# Altium project 200310 Brake Module R3.PrjPcb
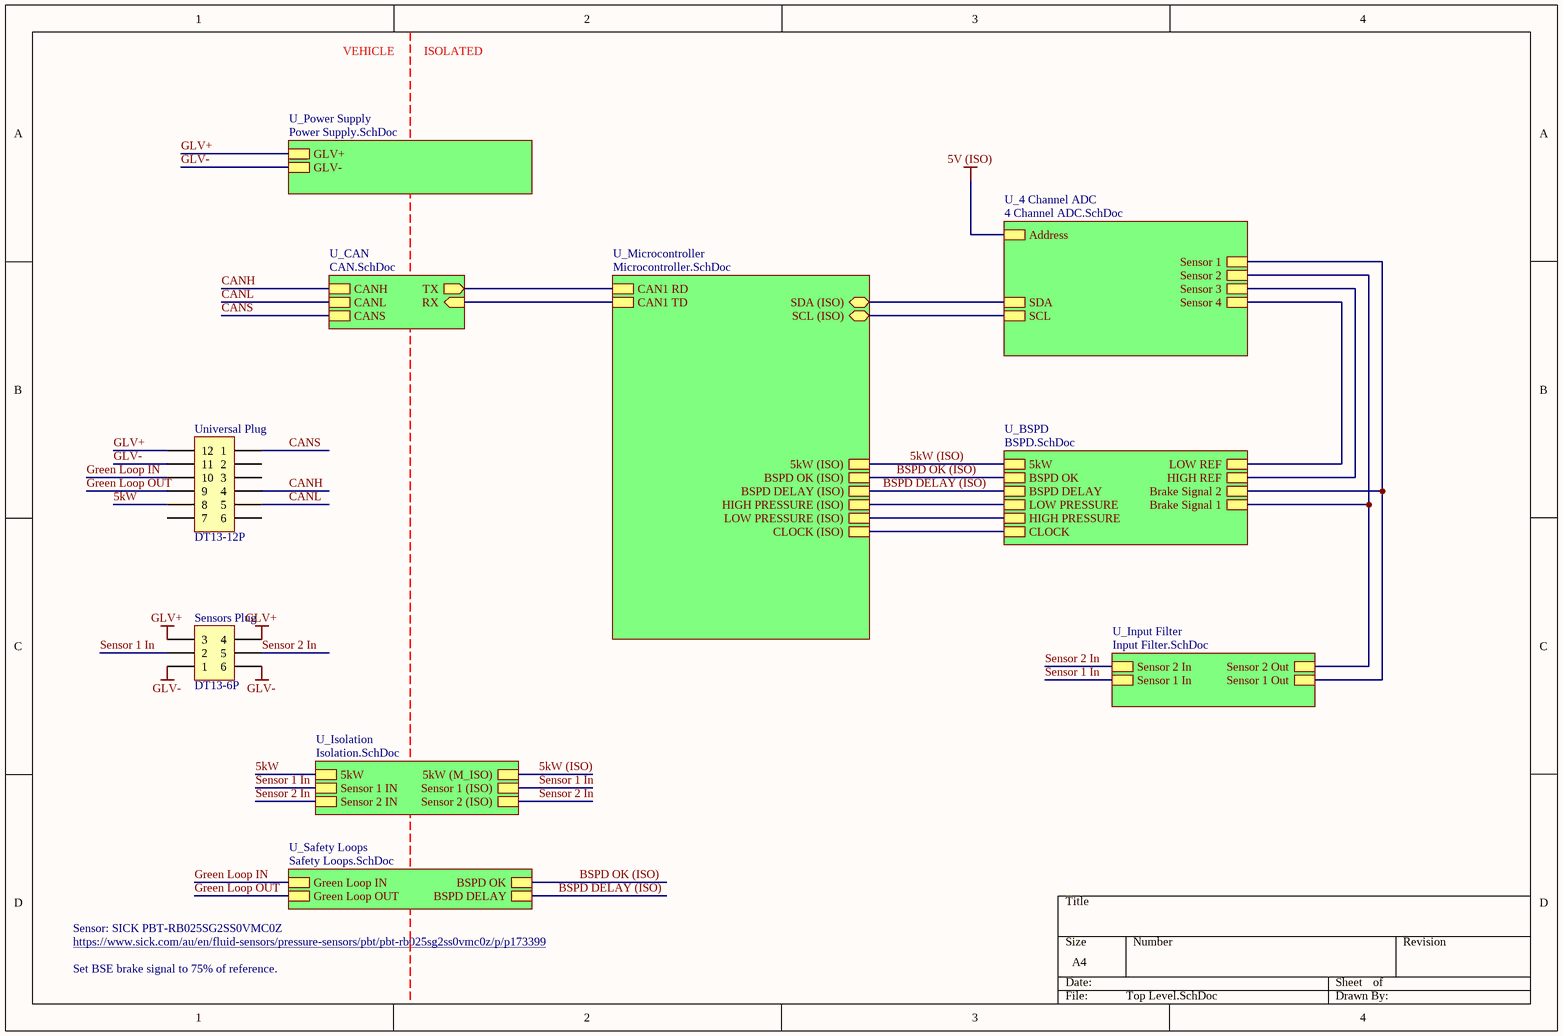
[diagram p0: Top Level.SchDoc]
8 sheets, 139 parts. Net scope: hierarchical (ports join the sheet entries above them; power ports are global).
Board file: Brake Module PCB.PcbDoc
Sheets:
  Top Level.SchDoc
    U_BSPD = BSPD.SchDoc
    U_4 Channel ADC = 4 Channel ADC.SchDoc
    U_Input Filter = Input Filter.SchDoc
    U_Microcontroller = Microcontroller.SchDoc
    U_Safety Loops = Safety Loops.SchDoc
    U_CAN = CAN.SchDoc
    U_Isolation = Isolation.SchDoc

## Sheet Top Level.SchDoc
size A4

### Parts
Sensors_Plug  DT13-6P  [DT13-6P]
Universal_Plug  DT13-12P  [DT13-12P]

### Sub-sheets
U_4 Channel ADC = 4 Channel ADC.SchDoc: Address, SCL, SDA, Sensor 1, Sensor 2, Sensor 3, Sensor 4
U_BSPD = BSPD.SchDoc: BSPD OK, HIGH PRESSURE, LOW PRESSURE, CLOCK, HIGH REF, LOW REF, 5kW, Brake Signal 1, Brake Signal 2, BSPD DELAY
U_CAN = CAN.SchDoc: CANS, RX (in), CANL, CANH, TX (out)
U_Input Filter = Input Filter.SchDoc: Sensor 1 In, Sensor 1 Out, Sensor 2 In, Sensor 2 Out
U_Isolation = Isolation.SchDoc: 5kW, 5kW (M_ISO), Sensor 2 IN, Sensor 1 IN, Sensor 2 (ISO), Sensor 1 (ISO)
U_Microcontroller = Microcontroller.SchDoc: BSPD OK (ISO), 5kW (ISO), CLOCK (ISO), HIGH PRESSURE (ISO), LOW PRESSURE (ISO), SDA (ISO) (bidir), SCL (ISO) (bidir), CAN1 RD, CAN1 TD, BSPD DELAY (ISO)
U_Power Supply = Power Supply.SchDoc (file not in this document): GLV+, GLV-
U_Safety Loops = Safety Loops.SchDoc: Green Loop OUT, Green Loop IN, BSPD OK, BSPD DELAY

### Nets
GLV+: Sensors_Plug.3 Sensors_Plug.4 Universal_Plug.12 ; sheet U_Power Supply/GLV+
GLV-: Sensors_Plug.1 Sensors_Plug.6 Universal_Plug.11 ; sheet U_Power Supply/GLV-
5kW: Universal_Plug.8 ; sheet U_Isolation/5kW
5kW (ISO): sheet U_BSPD/5kW, sheet U_Microcontroller/5kW (ISO), sheet U_Isolation/5kW (M_ISO)
BSPD DELAY (ISO): sheet U_BSPD/BSPD DELAY, sheet U_Microcontroller/BSPD DELAY (ISO), sheet U_Safety Loops/BSPD DELAY
BSPD OK (ISO): sheet U_BSPD/BSPD OK, sheet U_Microcontroller/BSPD OK (ISO), sheet U_Safety Loops/BSPD OK  [project net BSPD OK]
CANH: Universal_Plug.4 ; sheet U_CAN/CANH
CANL: Universal_Plug.5 ; sheet U_CAN/CANL
CANS: Universal_Plug.1 ; sheet U_CAN/CANS
CLOCK: sheet U_BSPD/CLOCK, sheet U_Microcontroller/CLOCK (ISO)
Green Loop IN: Universal_Plug.10 ; sheet U_Safety Loops/Green Loop IN
Green Loop OUT: Universal_Plug.9 ; sheet U_Safety Loops/Green Loop OUT
H REF: sheet U_BSPD/HIGH REF, sheet U_4 Channel ADC/Sensor 3
L REF: sheet U_BSPD/LOW REF, sheet U_4 Channel ADC/Sensor 4
Sensor 1 In: Sensors_Plug.2 ; sheet U_Input Filter/Sensor 1 In, sheet U_Isolation/Sensor 1 IN, sheet U_Isolation/Sensor 1 (ISO)
Sensor 2 In: Sensors_Plug.5 ; sheet U_Input Filter/Sensor 2 In, sheet U_Isolation/Sensor 2 IN, sheet U_Isolation/Sensor 2 (ISO)
NetC48_2: sheet U_BSPD/Brake Signal 2, sheet U_4 Channel ADC/Sensor 1, sheet U_Input Filter/Sensor 1 Out
NetC49_2: sheet U_BSPD/Brake Signal 1, sheet U_4 Channel ADC/Sensor 2, sheet U_Input Filter/Sensor 2 Out
NetCAN_RX_TP_1: sheet U_Microcontroller/CAN1 TD, sheet U_CAN/RX
NetCAN_TX_TP_1: sheet U_Microcontroller/CAN1 RD, sheet U_CAN/TX
NetP9_1: sheet U_BSPD/HIGH PRESSURE, sheet U_Microcontroller/LOW PRESSURE (ISO)
NetP11_1: sheet U_BSPD/LOW PRESSURE, sheet U_Microcontroller/HIGH PRESSURE (ISO)
NetR43_1: sheet U_4 Channel ADC/SCL, sheet U_Microcontroller/SCL (ISO)
NetR44_1: sheet U_4 Channel ADC/SDA, sheet U_Microcontroller/SDA (ISO)

Not connected (* = marked no-connect by the designer): Universal_Plug 2 3 6 7

### Notes on the sheet
- VEHICLE
- ISOLATED
- Sensor: SICK PBT-RB025SG2SS0VMC0Z
- https://www.sick.com/au/en/fluid-sensors/pressure-sensors/pbt/pbt-rb025sg2ss0vmc0z/p/p173399
- Set BSE brake signal to 75% of reference.

### Library data of the parts
Sensors_Plug = DT13-6P[[/\]]DT13-6P: Positions: 6; Pitch: 4.44mm; Row Spacing: 6.35mm; Angle: 90; Flange: Yes; Contact: Copper Alloy; Part Number: DT13-6P; Digikey Part Number: 1734-1025-ND; Digikey Link: https://www.digikey.com/product-detail/en/te-connectivity-deutsch-connectors/DT13-6P/1734-1025-ND/6566589
Universal_Plug = DT13-12P[[/\]]DT13-12P: Positions: 12; Pitch: 4.44mm; Row Spacing: 6.35mm; Angle: 90; Flange: Yes; Contact: Nickel; Part Number: DT13-12P; Digikey Part Number: 1734-1451-ND; Digikey Link: https://www.digikey.com.au/product-detail/en/te-connectivity-deutsch-connectors/DT13-12PA/1734-1451-ND/7220123

## Sheet BSPD.SchDoc
size A4
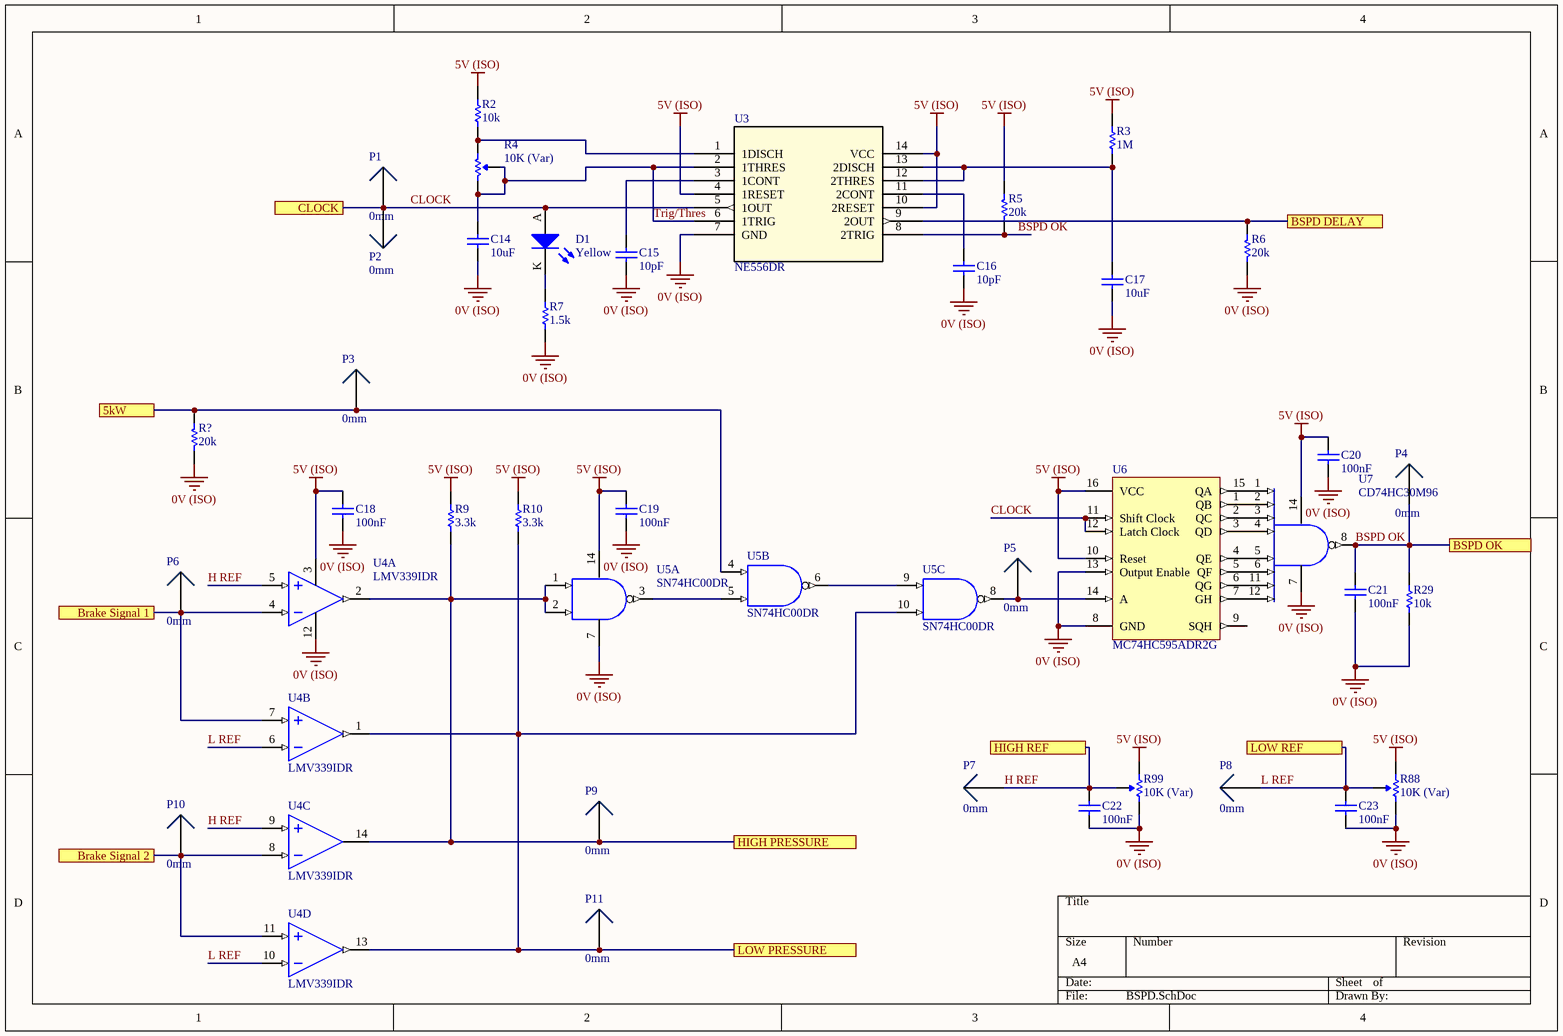
[diagram p1: BSPD.SchDoc]

### Parts
C14  10uF  [0805]
C15  10pF  [0805]
C16  10pF  [0805]
C17  10uF  [0805]
C18  100nF  [0805]
C19  100nF  [0805]
C20  100nF  [0805]
C21  100nF  [0805]
C22  100nF  [0805]
C23  100nF  [0805]
D1  Yellow  [0805 LED]
P1  0mm  [SMD Test Point]
P2  0mm  [TH Test Point]
P3  0mm  [SMD Test Point]
P4  0mm  [SMD Test Point]
P5  0mm  [SMD Test Point]
P6  0mm  [TH Test Point]
P7  0mm  [TH Test Point]
P8  0mm  [TH Test Point]
P9  0mm  [SMD Test Point]
P10  0mm  [TH Test Point]
P11  0mm  [SMD Test Point]
R2  10k  [0805]
R3  1M  [0805]
R4  10K (Var)  [B 3296]
R5  20k  [0805]
R6  20k  [0805]
R7  1.5k  [0805]
R9  3.3k  [0805]
R10  3.3k  [0805]
R29  10k  [0805]
R88  10K (Var)  [B 3296]
R99  10K (Var)  [B 3296]
R?  20k  [0805]
U3  NE556DR  [TI 14-SOIC]
U4  LMV339IDR  [TI 14-SOIC]  (parts A,B,C,D of 4)
U5  SN74HC00DR  [TI 14-SOIC]  (parts A,B,C of 4)
U6  MC74HC595ADR2G  [ON 16-SOIC]
U7  CD74HC30M96  [TI 14-SOIC]

### Ports
5kW, Brake Signal 1, Brake Signal 2, BSPD DELAY, BSPD OK, CLOCK, HIGH PRESSURE, HIGH REF, LOW PRESSURE, LOW REF

### Nets
0V (ISO): C14.1 C15.1 C16.1 C17.1 C18.1 C19.1 C20.1 C21.1 C22.1 C23.1 R6.2 R7.1 R29.1 R88.1(CCW) R99.1(CCW) R?.2 U3.7(GND) U4.12(V-) U5.7(GND) U6.8(GND) U6.13(Output_Enable) U7.7(GND)
5V (ISO): C18.2 C19.2 C20.2 R2.2 R3.2 R5.1 R9.2 R10.2 R88.3(CW) R99.3(CW) U3.4(1RESET) U3.10(2RESET) U3.14(VCC) U4.3(V+) U5.14(VCC) U6.10(Reset) U6.16(VCC) U7.14(VCC)
5kW (ISO): P3.1 R?.1 U5.4(2A) ; port 5kW
BSPD DELAY (ISO): R6.1 U3.9(2OUT) ; port BSPD DELAY
BSPD OK: C21.2 P4.1 R5.2 R29.2 U3.8(2TRIG) U7.8(Output) ; port BSPD OK
CLOCK: D1.A P1.1 P2.1 U3.5(1OUT) U6.11(Shift_Clock) U6.12(Latch_Clock) ; port CLOCK
H REF: C22.2 P7.1 R99.2(Wiper) U4.5(IN_A+) U4.9(IN_C+) ; port HIGH REF
L REF: C23.2 P8.1 R88.2(Wiper) U4.6(IN_B-) U4.10(IN_D-) ; port LOW REF
Trig/Thres: C14.2 R4.1(CCW) R4.2(Wiper) U3.2(1THRES) U3.6(1TRIG)
NetC15_2: C15.2 U3.3(1CONT)
NetC16_2: C16.2 U3.11(2CONT)
NetC17_2: C17.2 R3.1 U3.12(2THRES) U3.13(2DISCH)
NetC48_2: P10.1 U4.8(IN_C-) U4.11(IN_D+) ; port Brake Signal 2
NetC49_2: P6.1 U4.4(IN_A-) U4.7(IN_B+) ; port Brake Signal 1
NetD1_K: D1.K R7.2
NetP5_1: P5.1 U5.8(3Y) U6.14(A)
NetP9_1: P9.1 R9.1 U4.2(OUT_A) U4.14(OUT_C) U5.1(1A) U5.2(1B) ; port HIGH PRESSURE
NetP11_1: P11.1 R10.1 U4.1(OUT_B) U4.13(OUT_D) U5.10(3B) ; port LOW PRESSURE
NetR2_1: R2.1 R4.3(CW) U3.1(1DISCH)
NetU5_3: U5.3(1Y) U5.5(2B)
NetU5_6: U5.6(2Y) U5.9(3A)
NetU6_1: U6.1(QB) U7.2(Input)
NetU6_2: U6.2(QC) U7.3(Input)
NetU6_3: U6.3(QD) U7.4(Input)
NetU6_4: U6.4(QE) U7.5(Input)
NetU6_5: U6.5(QF) U7.6(Input)
NetU6_6: U6.6(QG) U7.11(Input)
NetU6_7: U6.7(GH) U7.12(Input)
NetU6_15: U6.15(QA) U7.1(Input)

Not connected (* = marked no-connect by the designer): U6 9(SQH)

### Library data of the parts
C14 C17 = GRM21BR6YA106KE43L: Manufacturer: muRata; Tolerance: 10%; Material: X5R; Rated Voltage: 50V; Part Number: GRM21BR6YA106KE43L; Value: 10uF; Digikey Part Number: 490-10514-6-ND
C15 C16 = GCM21B5C1H100JA37L: Manufacturer: muRata; Tolerance: 5%; Material: C0G; Rated Voltage: 50V; Part Number: GCM21B5C1H100JA37L; Value: 10pF
C18-C23 = GCM21BR71E104KA37L: Manufacturer: muRata; Tolerance: 10%; Material: X7R; Rated Voltage: 25V; Part Number: GCM21BR71E104KA37L; Value: 100nF
D1 = SML-211YTT86: Yellow LED Indication - Discrete 1.75V 0805 (2012 Metric); Manufacturer: ROHM Semiconductor; Part Number: SML-211YTT86; Colour: Yellow; Digikey Part Number: 511-1293-1-ND; Digikey Link: https://www.digikey.com/product-detail/en/rohm-semiconductor/SML-211YTT86/511-1293-1-ND/637106
P1 P3-P5 P9 P11 = SMD Test Point: Positions: 1; Row Spacing: 0; Flange: No; Contact: NA; Part Number: SMD Test Point; Pitch: 0mm; Angle: 0
P2 P6-P8 P10 = TH Test Point: Positions: 1; Angle: 0; Flange: No; Contact: NA; Part Number: TH Test Point; Pitch: 0mm; Row Spacing: 0mm
R2 R29 = RC0805FR0710KL: Manufacturer: YAGEO; Tolerance: 0.01; Rated Voltage: 0.125W; Part Number: RC0805FR0710KL; Value: 10k; Material: FR-07
R3 = RC0805FR071ML: Manufacturer: YAGEO; Tolerance: 0.01; Rated Voltage: 0.125W; Part Number: RC0805FR071ML; Value: 1M; Material: FR-07
R4 R88 R99 = 3296W-1-103LF: Manufacturer: Bournes Inc; Tolerance: 0.1; Rated Voltage: 0.5W; Part Number: 3296W-1-103LF; Value: 10K (Var); Digikey Part Number: 3296W-103LF-ND
R5 R6 R? = RC0805FR0720KL: Manufacturer: YAGEO; Tolerance: 0.01; Rated Voltage: 0.125W; Part Number: RC0805FR0720KL; Value: 20k; Material: FR-07
R7 = RC0805FR071K5L: Manufacturer: YAGEO; Tolerance: 0.01; Rated Voltage: 0.125W; Part Number: RC0805FR071K5L; Value: 1.5k; Material: FR-07
R9 R10 = RC0805FR073K3L: Manufacturer: YAGEO; Tolerance: 0.01; Rated Voltage: 0.125W; Part Number: RC0805FR073K3L; Value: 3.3k; Material: FR-07
U3 = NE556DR: IC OSC TIMER DUAL 100KHZ 14SOIC; Manufacturer: Texas Instruments; Part Number: NE556DR; Digikey Part Number: 296-26240-1-ND; Digikey Link: https://www.digikey.com/product-detail/en/texas-instruments/NE556DR/296-26240-1-ND/2254905
U4 = LMV339IDR: Comparator General Purpose Open Collector 14-SOIC; Manufacturer: Texas Instruments; Part Number: LMV339IDR; Digikey Part Number: 296-6611-2-ND; Digikey Link: https://www.digikey.com/product-detail/en/texas-instruments/LMV339MTX-NOPB/296-35446-1-ND/3739150
U5 = SN74HC00DR: NAND Gate IC 4 Channel 14-SOIC; Manufacturer: Texas Instruments; Part Number: SN74HC00DR; Digikey Part Number: 296-1187-2-ND; Digikey Link: https://www.digikey.com.au/product-detail/en/texas-instruments/SN74HC00DR/296-1187-2-ND/276830
U6 = MC74HC595ADR2G: IC SHIFT REGISTR 8BIT 3ST 16SOIC; Manufacturer: ON Semiconductor; Part Number: MC74HC595ADR2G; Digikey Part Number: MC74HC595ADR2GOSCT-ND; Digikey Link: https://www.digikey.com/product-detail/en/on-semiconductor/MC74HC595ADR2G/MC74HC595ADR2GOSCT-ND/1139727
U7 = CD74HC30M96: IC GATE NAND 1CH 8-INP 14SOIC; Manufacturer: Texas Instruments; Part Number: CD74HC30M96; Digikey Part Number: 296-14521-1-ND; Digikey Link: https://www.digikey.com/product-detail/en/texas-instruments/CD74HC30M96/296-14521-1-ND/555580

## Sheet 4 Channel ADC.SchDoc
size A4
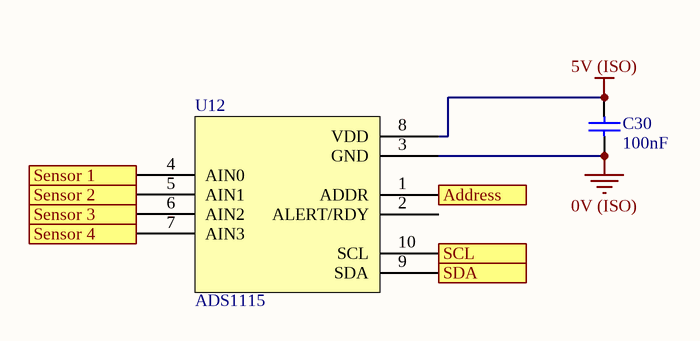
[diagram p2: 4 Channel ADC.SchDoc]

### Parts
C30  100nF  [0805]
U12  ADS1115  [TI 10-VSSOP]

### Ports
Address, SCL, SDA, Sensor 1, Sensor 2, Sensor 3, Sensor 4

### Nets
0V (ISO): C30.1 U12.3(GND)
5V (ISO): C30.2 U12.1(ADDR) U12.8(VDD) ; port Address
H REF: U12.6(AIN2) ; port Sensor 3
L REF: U12.7(AIN3) ; port Sensor 4
NetC48_2: U12.4(AIN0) ; port Sensor 1
NetC49_2: U12.5(AIN1) ; port Sensor 2
NetR43_1: U12.10(SCL) ; port SCL
NetR44_1: U12.9(SDA) ; port SDA

Not connected (* = marked no-connect by the designer): U12 2(ALERT/RDY)

### Library data of the parts
C30 = GCM21BR71E104KA37L: as C18 on sheet BSPD; Part Number: GCM21BR71E104KA37L; Value: 100nF
U12 = ADS1115: 16 Bit Analog to Digital Converter 2, 4 Input 1 Sigma-Delta 10-VSSOP; Manufacturer: Texas Instruments; Part Number: ADS1115; Digikey Part Number: 296-38849-1-ND; Digikey Link: https://www.digikey.com/product-detail/en/texas-instruments/ADS1115IDGSR/296-38849-1-ND/5142969

## Sheet Input Filter.SchDoc
size A4
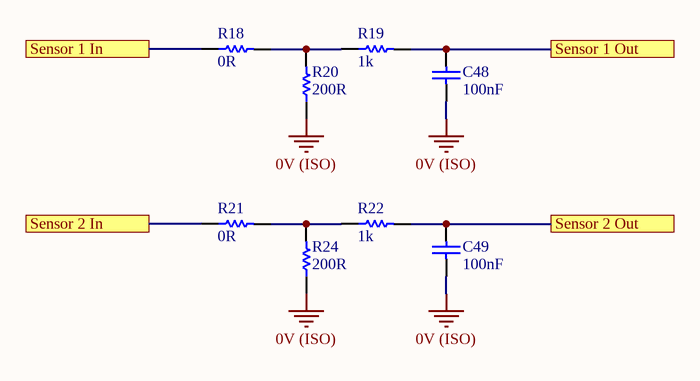
[diagram p3: Input Filter.SchDoc]

### Parts
C48  100nF  [0805]
C49  100nF  [0805]
R18  0R  [0805]
R19  1k  [0805]
R20  200R  [0805]
R21  0R  [0805]
R22  1k  [0805]
R24  200R  [0805]

### Ports
Sensor 1 In, Sensor 1 Out, Sensor 2 In, Sensor 2 Out

### Nets
0V (ISO): C48.1 C49.1 R20.1 R24.1
Sensor 1 In: R18.1 ; port Sensor 1 In
Sensor 2 In: R21.1 ; port Sensor 2 In
NetC48_2: C48.2 R19.2 ; port Sensor 1 Out
NetC49_2: C49.2 R22.2 ; port Sensor 2 Out
NetR18_2: R18.2 R19.1 R20.2
NetR21_2: R21.2 R22.1 R24.2

### Library data of the parts
C48 C49 = GCM21BR71E104KA37L: as C18 on sheet BSPD; Part Number: GCM21BR71E104KA37L; Value: 100nF
R18 R21 = RC0805FR070RL: Manufacturer: YAGEO; Tolerance: 0.01; Rated Voltage: 0.125W; Part Number: RC0805FR070RL; Value: 0R; Material: FR-07
R19 R22 = RC0805FR071KL: Manufacturer: YAGEO; Tolerance: 0.01; Rated Voltage: 0.125W; Part Number: RC0805FR071KL; Value: 1k; Material: FR-07
R20 R24 = RC0805FR07200RL: Manufacturer: YAGEO; Tolerance: 0.01; Rated Voltage: 0.125W; Part Number: RC0805FR07200RL; Value: 200R; Material: FR-07

## Sheet Microcontroller.SchDoc
size A3
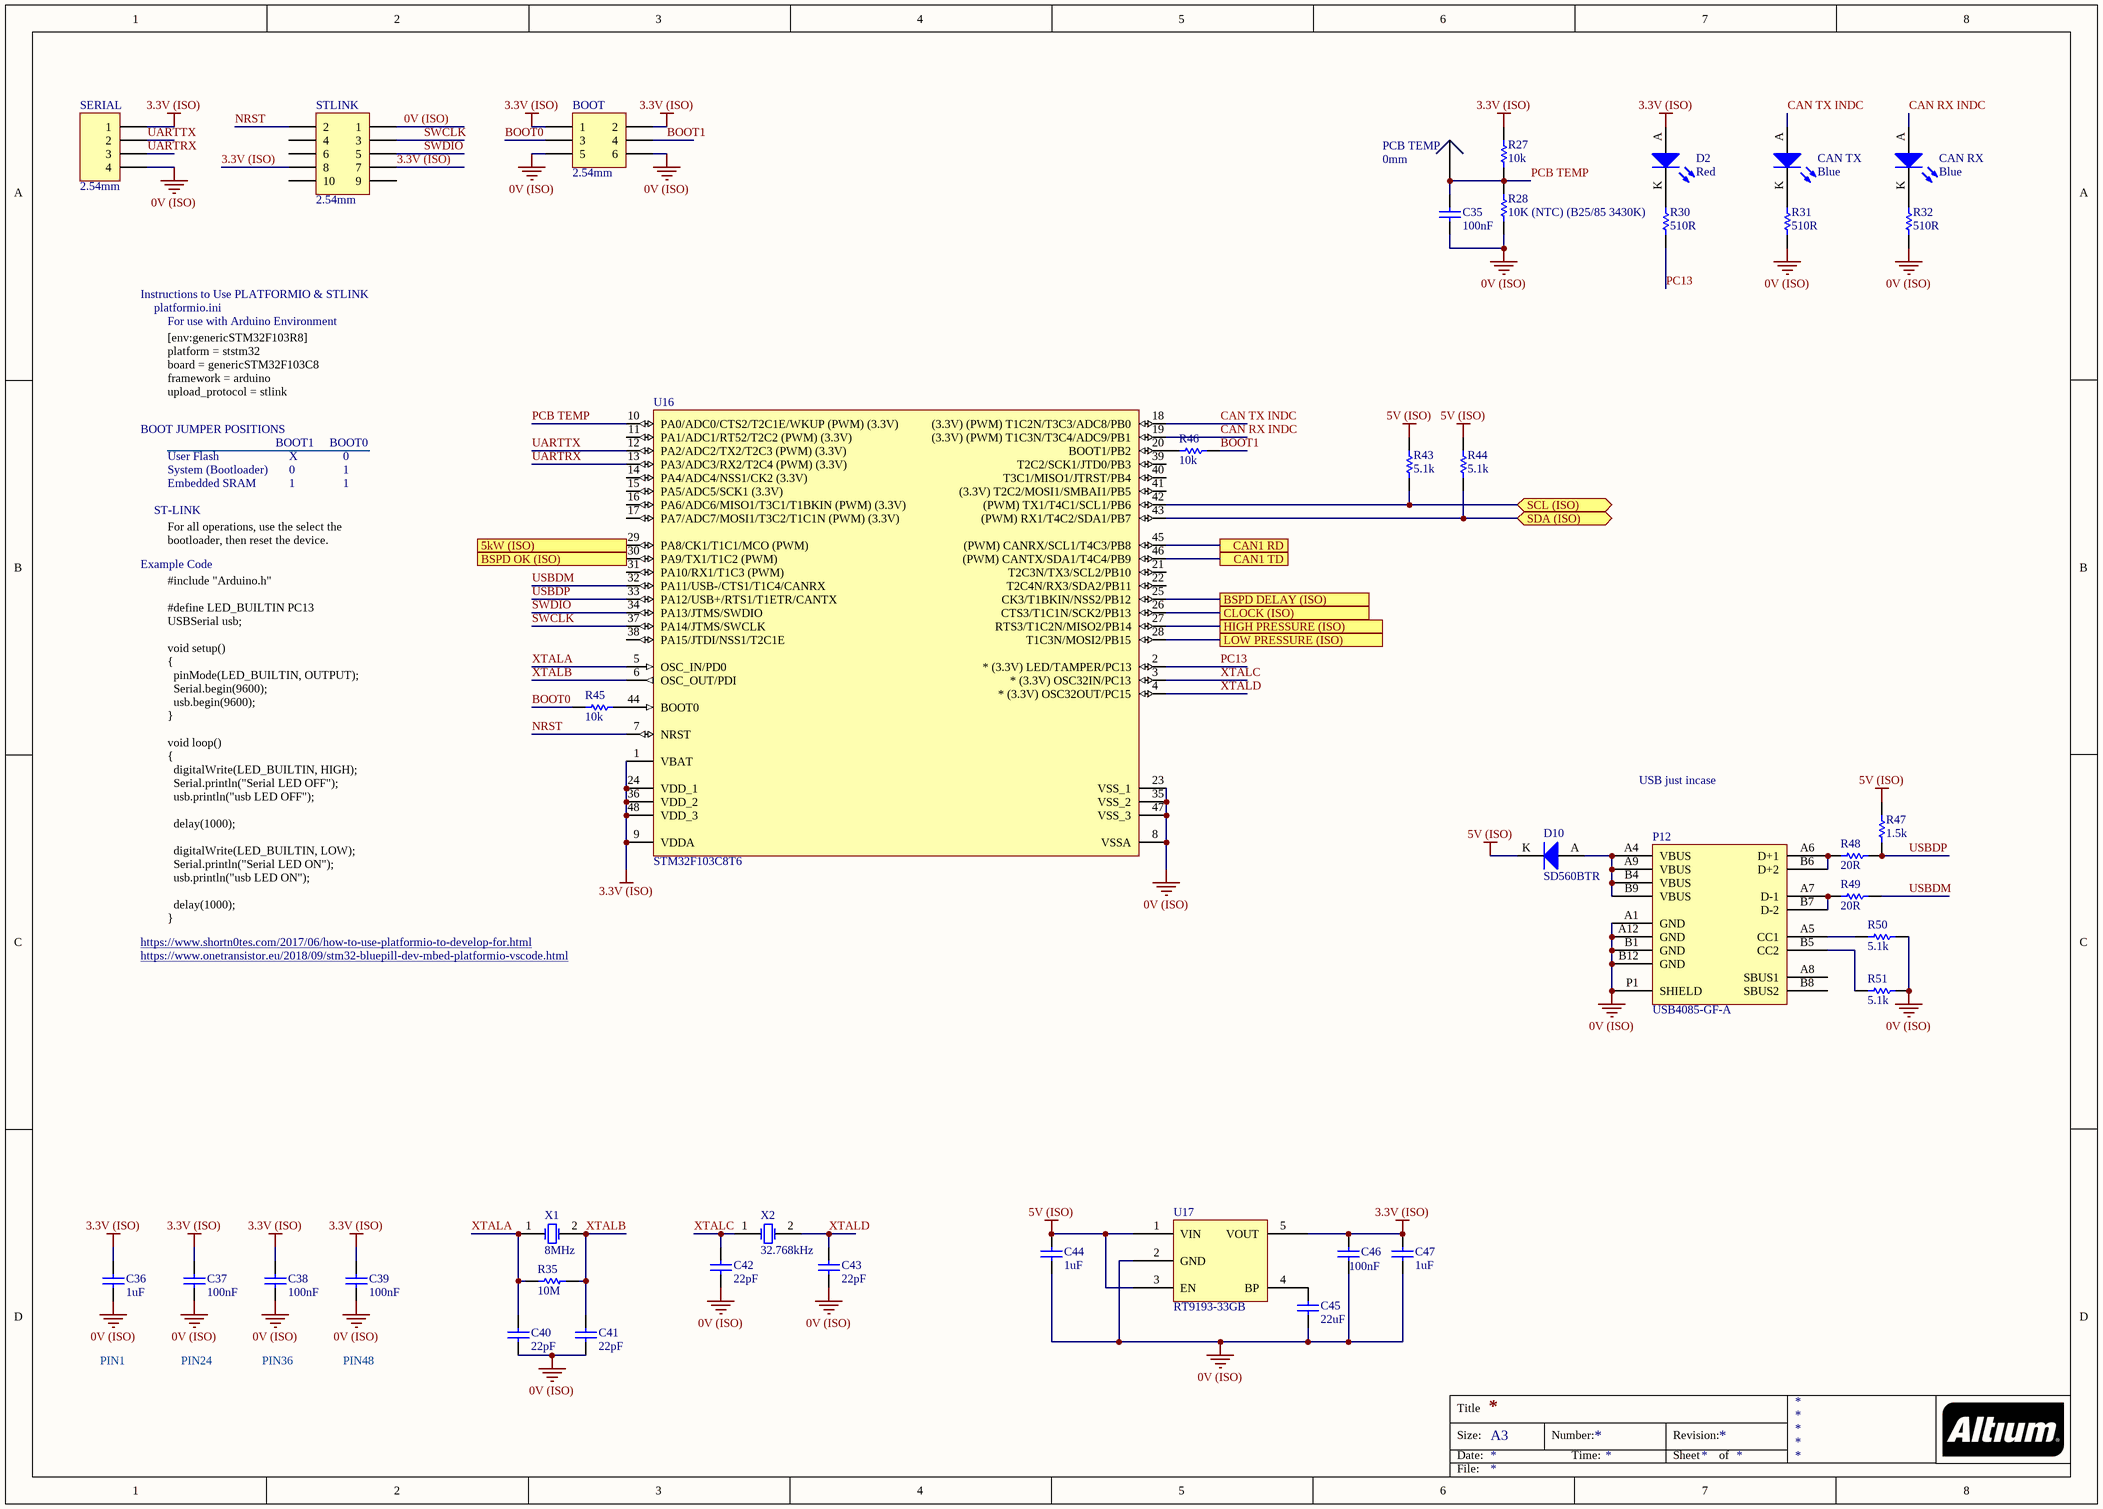
[diagram p4: Microcontroller.SchDoc]

### Parts
BOOT  2.54mm  [TH 2.54mm Header 2x3]
C35  100nF  [0805]
C36  1uF  [0805]
C37  100nF  [0805]
C38  100nF  [0805]
C39  100nF  [0805]
C40  22pF  [0805]
C41  22pF  [0805]
C42  22pF  [0805]
C43  22pF  [0805]
C44  1uF  [0805]
C45  22uF  [0805]
C46  100nF  [0805]
C47  1uF  [0805]
CAN_RX  Blue  [0805 LED]
CAN_TX  Blue  [0805 LED]
D2  Red  [0805 LED]
D10  SD560BTR  [SMB Diode]
P12  USB4085-GF-A  [USB4085-GF-A]
PCB_TEMP  0mm  [SMD Test Point]
R27  10k  [0805]
R28  10K (NTC) (B25/85 3430K)  [0805]
R30  510R  [0805]
R31  510R  [0805]
R32  510R  [0805]
R35  10M  [0805]
R43  5.1k  [0805]
R44  5.1k  [0805]
R45  10k  [0805]
R46  10k  [0805]
R47  1.5k  [0805]
R48  20R  [0805]
R49  20R  [0805]
R50  5.1k  [0805]
R51  5.1k  [0805]
SERIAL  2.54mm  [TH 2.54mm Header 1x4]
STLINK  2.54mm  [TH 2.54mm Header 2x5]
U16  STM32F103C8T6  [STM 48-LQFP]
U17  RT9193-33GB  [RICHTEK SOT-23-5]
X1  8MHz  [Abracon HC-49/US]
X2  32.768kHz  [EPSON 2-SMD]

### Ports
5kW (ISO), BSPD DELAY (ISO), BSPD OK (ISO), CAN1 RD, CAN1 TD, CLOCK (ISO), HIGH PRESSURE (ISO), LOW PRESSURE (ISO), SCL (ISO) (bidir), SDA (ISO) (bidir)

### Nets
0V (ISO): BOOT.5 BOOT.6 C35.1 C36.1 C37.1 C38.1 C39.1 C40.1 C41.1 C42.1 C43.1 C44.1 C45.1 C46.1 C47.1 P12.A1(GND) P12.A12(GND) P12.B1(GND) P12.B12(GND) P12.P1(SHIELD) R28.1 R31.1 R32.1 R50.2 R51.2 SERIAL.4 STLINK.1 U16.8(VSSA) U16.23(VSS_1) U16.35(VSS_2) U16.47(VSS_3) U17.2(GND)
3.3V (ISO): BOOT.1 BOOT.2 C36.2 C37.2 C38.2 C39.2 C46.2 C47.2 D2.A R27.2 SERIAL.1 STLINK.7 STLINK.8 U16.1(VBAT) U16.9(VDDA) U16.24(VDD_1) U16.36(VDD_2) U16.48(VDD_3) U17.5(VOUT)
5V (ISO): C44.2 D10.K R43.2 R44.2 R47.2 U17.1(VIN) U17.3(EN)
5kW (ISO): U16.29(PA8/CK1/T1C1/MCO_(PWM)) ; port 5kW (ISO)
BOOT0: BOOT.3 R45.1
BOOT1: BOOT.4 R46.2
BSPD DELAY (ISO): U16.25(CK3/T1BKIN/NSS2/PB12) ; port BSPD DELAY (ISO)
BSPD OK: U16.30(PA9/TX1/T1C2_(PWM)) ; port BSPD OK (ISO)
CAN RX INDC: CAN_RX.A U16.19((3.3V)_(PWM)_T1C3N/T3C4/ADC9/PB1)
CAN TX INDC: CAN_TX.A U16.18((3.3V)_(PWM)_T1C2N/T3C3/ADC8/PB0)
CLOCK: U16.26(CTS3/T1C1N/SCK2/PB13) ; port CLOCK (ISO)
NRST: STLINK.2 U16.7(NRST)
PC13: R30.1 U16.2(*_(3.3V)_LED/TAMPER/PC13)
PCB TEMP: C35.2 PCB_TEMP.1 R27.1 R28.2 U16.10(PA0/ADC0/CTS2/T2C1E/WKUP_(PWM)_(3.3V))
SWCLK: STLINK.3 U16.37(PA14/JTMS/SWCLK)
SWDIO: STLINK.5 U16.34(PA13/JTMS/SWDIO)
UARTRX: SERIAL.3 U16.13(PA3/ADC3/RX2/T2C4_(PWM)_(3.3V))
UARTTX: SERIAL.2 U16.12(PA2/ADC2/TX2/T2C3_(PWM)_(3.3V))
USBDM: R49.2 U16.32(PA11/USB-/CTS1/T1C4/CANRX)
USBDP: R47.1 R48.2 U16.33(PA12/USB+/RTS1/T1ETR/CANTX)
XTALA: C40.2 R35.1 U16.5(OSC_IN/PD0) X1.1(OSC1)
XTALB: C41.2 R35.2 U16.6(OSC_OUT/PDI) X1.2(OSC2)
XTALC: C42.2 U16.3(*_(3.3V)_OSC32IN/PC13) X2.1(OSC1)
XTALD: C43.2 U16.4(*_(3.3V)_OSC32OUT/PC15) X2.2(OSC2)
NetC45_2: C45.2 U17.4(BP)
NetCAN_RX_K: CAN_RX.K R32.2
NetCAN_RX_TP_1: U16.46((PWM)_CANTX/SDA1/T4C4/PB9) ; port CAN1 TD
NetCAN_TX_K: CAN_TX.K R31.2
NetCAN_TX_TP_1: U16.45((PWM)_CANRX/SCL1/T4C3/PB8) ; port CAN1 RD
NetD2_K: D2.K R30.2
NetD10_A: D10.A P12.A4(VBUS) P12.A9(VBUS) P12.B4(VBUS) P12.B9(VBUS)
NetP9_1: U16.28(T1C3N/MOSI2/PB15) ; port LOW PRESSURE (ISO)
NetP11_1: U16.27(RTS3/T1C2N/MISO2/PB14) ; port HIGH PRESSURE (ISO)
NetP12_A5: P12.A5(CC1) R50.1
NetP12_A6: P12.A6(D+1) P12.B6(D+2) R48.1
NetP12_A7: P12.A7(D-1) P12.B7(D-2) R49.1
NetP12_B5: P12.B5(CC2) R51.1
NetR43_1: R43.1 U16.42((PWM)_TX1/T4C1/SCL1/PB6) ; port SCL (ISO)
NetR44_1: R44.1 U16.43((PWM)_RX1/T4C2/SDA1/PB7) ; port SDA (ISO)
NetR45_2: R45.2 U16.44(BOOT0)
NetR46_1: R46.1 U16.20(BOOT1/PB2)

Not connected (* = marked no-connect by the designer): P12 A8(SBUS1) B8(SBUS2); STLINK 4 6 9 10; U16 11(PA1/ADC1/RT52/T2C2_(PWM)_(3.3V)) 14(PA4/ADC4/NSS1/CK2_(3.3V)) 15(PA5/ADC5/SCK1_(3.3V)) 16(PA6/ADC6/MISO1/T3C1/T1BKIN_(PWM)_(3.3V)) 17(PA7/ADC7/MOSI1/T3C2/T1C1N_(PWM)_(3.3V)) 21(T2C3N/TX3/SCL2/PB10) 22(T2C4N/RX3/SDA2/PB11) 31(PA10/RX1/T1C3_(PWM)) 38(PA15/JTDI/NSS1/T2C1E) 39(T2C2/SCK1/JTD0/PB3) 40(T3C1/MISO1/JTRST/PB4) 41((3.3V)_T2C2/MOSI1/SMBAI1/PB5)

### Notes on the sheet
- Instructions to Use PLATFORMIO & STLINK
- platformio.ini
- For use with Arduino Environment
- BOOT JUMPER POSITIONS
- [env:genericSTM32F103R8]
  platform = ststm32
  board = genericSTM32F103C8
  framework = arduino
  upload_protocol = stlink
- BOOT1
- BOOT0
- ST-LINK
- User Flash
- System (Bootloader)
- Embedded SRAM
- X
- 1
- 0
- Example Code
- For all operations, use the select the bootloader, then reset the device.
- USB just incase
- #include "Arduino.h"
  #define LED_BUILTIN PC13
  USBSerial usb;
  void setup()
  {
  pinMode(LED_BUILTIN, OUTPUT);
  Serial.begin(9600);
  usb.begin(9600);
  }
  void loop()
  {
  digitalWrite(LED_BUILTIN, HIGH);
  Serial.println("Serial LED OFF");
  usb.println("usb LED OFF");
  delay(1000);
  digitalWrite(LED_BUILTIN, LOW);
  Serial.println("Serial LED ON");
  usb.println("usb LED ON");
  delay(1000);
  }
- https://www.shortn0tes.com/2017/06/how-to-use-platformio-to-develop-for.html
- https://www.onetransistor.eu/2018/09/stm32-bluepill-dev-mbed-platformio-vscode.html
- PIN1
- PIN24
- PIN36
- PIN48
- Title
- Size:
- Date:
- A3
- Number:
- Time:
- Revision:
- Sheet
- of
- File:

### Library data of the parts
BOOT = TH 2.54mm Header 2x3: Positions: 6; Angle: 0; Flange: No; Contact: NA; Part Number: TH 2.54mm Header 2x3; Pitch: 2.54mm; Row Spacing: 2.54mm
C35 C37-C39 C46 = GCM21BR71E104KA37L: as C18 on sheet BSPD; Part Number: GCM21BR71E104KA37L; Value: 100nF
C36 C44 C47 = AC0805KKX7R8BB105: Manufacturer: YAGEO; Tolerance: 10%; Material: X7R; Rated Voltage: 25V; Part Number: AC0805KKX7R8BB105; Value: 1uF
C40-C43 = GCM21B5C1H220JA37L: Manufacturer: muRata; Tolerance: 5%; Material: C0G; Rated Voltage: 50V; Part Number: GCM21B5C1H220JA37L; Value: 22pF
C45 = GRM21BR61A226ME51L: Manufacturer: muRata; Tolerance: 20%; Material: X5R; Rated Voltage: 10V; Part Number: GRM21BR61A226ME51L; Value: 22uF; Digikey Part Number: 490-10511-1-ND
CAN_RX CAN_TX = SML-MN2BCTT86C: LED BLUE CLEAR 2012 SMD; Manufacturer: ROHM Semiconductor; Part Number: SML-MN2BCTT86C; Colour: Blue; Digikey Part Number: 846-1207-1-ND; Digikey Link: https://www.digikey.com/product-detail/en/rohm-semiconductor/SMLMN2BCTT86C/846-1207-1-ND/6057239
D2 = SML-210LTT86: Red LED Indication - Discrete 1.75V 0805 (2012 Metric); Manufacturer: ROHM Semiconductor; Part Number: SML-210LTT86; Colour: Red; Digikey Part Number: 511-1286-1-ND; Digikey Link: https://www.digikey.com/product-detail/en/rohm-semiconductor/SML-210LTT86/511-1286-1-ND/637099
D10 = SD560BTR: 1.2V_F 600V 5A SMB; Manufacturer: SMC Diode Solutions; Part Number: SD560BTR; Digikey Part Number: 1655-1530-2-ND; Digikey Link: https://www.digikey.com/product-detail/en/smc-diode-solutions/SD560BTR/1655-1530-2-ND/6022620
P12 = USB4085-GF-A: USB - C (Type - C) USB 2.0 Receptacle Connector 16 Position Through Hole, Right Angle; Angle: 90; Part Number: USB4085-GF-A; Digikey Part Number: 2073-USB4085-GF-ACT-ND; Digikey Link: https://www.digikey.ee/product-detail/en/gct/USB4085-GF-A/2073-USB4085-GF-ACT-ND/9859733
PCB_TEMP = SMD Test Point: as P1 on sheet BSPD; Part Number: SMD Test Point; Pitch: 0mm; Angle: 0
R27 R45 R46 = RC0805FR0710KL: as R2 on sheet BSPD; Part Number: RC0805FR0710KL; Value: 10k; Material: FR-07
R28 = NTCS0805E3103FLT: Manufacturer: Vishay Beyschlag; Tolerance: 0.01; Rated Voltage: 210mW; Part Number: NTCS0805E3103FLT; Value: 10K (NTC) (B25/85 3430K); Digikey Part Number: BC2733CT-ND
R30-R32 = RC0805FR07510RL: Manufacturer: YAGEO; Tolerance: 0.01; Rated Voltage: 0.125W; Part Number: RC0805FR07510RL; Value: 510R; Material: FR-07
R35 = RC0805FR0710ML: Manufacturer: YAGEO; Tolerance: 0.01; Rated Voltage: 0.125W; Part Number: RC0805FR0710ML; Value: 10M; Material: FR-07
R43 R44 R50 R51 = RC0805FR075K1L: Manufacturer: YAGEO; Tolerance: 0.01; Rated Voltage: 0.125W; Part Number: RC0805FR075K1L; Value: 5.1k; Material: FR-07
R47 = RC0805FR071K5L: as R7 on sheet BSPD; Part Number: RC0805FR071K5L; Value: 1.5k; Material: FR-07
R48 R49 = RC0805FR0720RL: Manufacturer: YAGEO; Tolerance: 0.01; Rated Voltage: 0.125W; Part Number: RC0805FR0720RL; Value: 20R; Material: FR-07
SERIAL = TH 2.54mm Header 1x4: Positions: 4; Angle: 0; Flange: No; Contact: NA; Part Number: TH 2.54mm Header 1x4; Pitch: 2.54mm; Row Spacing: 2.54mm
STLINK = TH 2.54mm Header 2x5: Positions: 10; Angle: 0; Flange: No; Contact: NA; Part Number: TH 2.54mm Header 2x5; Pitch: 2.54mm; Row Spacing: 2.54mm
U16 = STM32F103C8T6: ARM® Cortex®-M3 STM32F1 Microcontroller IC 32-Bit 72MHz 64KB (64K x 8) FLASH; Manufacturer: STMicroelectronics; Part Number: STM32F103C8T6; Digikey Part Number: 497-6063-ND; Digikey Link: https://www.digikey.com/product-detail/en/stmicroelectronics/STM32F103C8T6/497-6063-ND/1646338
U17 = RT9193-33GB: IC REG LINEAR 3.3V 300MA SOT23-5; Manufacturer: Richtek; Part Number: RT9193-33GB; Digikey Part Number: 1028-1014-1-ND; Digikey Link: https://www.digikey.com/products/en?keywords=1028-1014-1-ND
X1 = ABLS-8.000MHZ-B4-T: Manufacturer: Abracon LLC; Load Capacitance: 18pF; ESR: 80R; Part Number: ABLS-8.000MHZ-B4-T; Value: 8MHz; Digikey Part Number: 535-10212-2-ND; Digikey Link: https://www.digikey.com/product-detail/en/abracon-llc/ABLS-8.000MHZ-B4-T/535-10212-2-ND/2184155
X2 = FC-135 32.7680KA-A5: Manufacturer: EPSON; Load Capacitance: 12.5pF; ESR: 70k; Part Number: FC-135 32.7680KA-A5; Value: 32.768kHz; Digikey Part Number: SER4103TR-ND; Digikey Link: https://www.digikey.com/product-detail/en/epson/FC-135-32.7680KA-A5/SER4103TR-ND/5259895

## Sheet Safety Loops.SchDoc
size A4
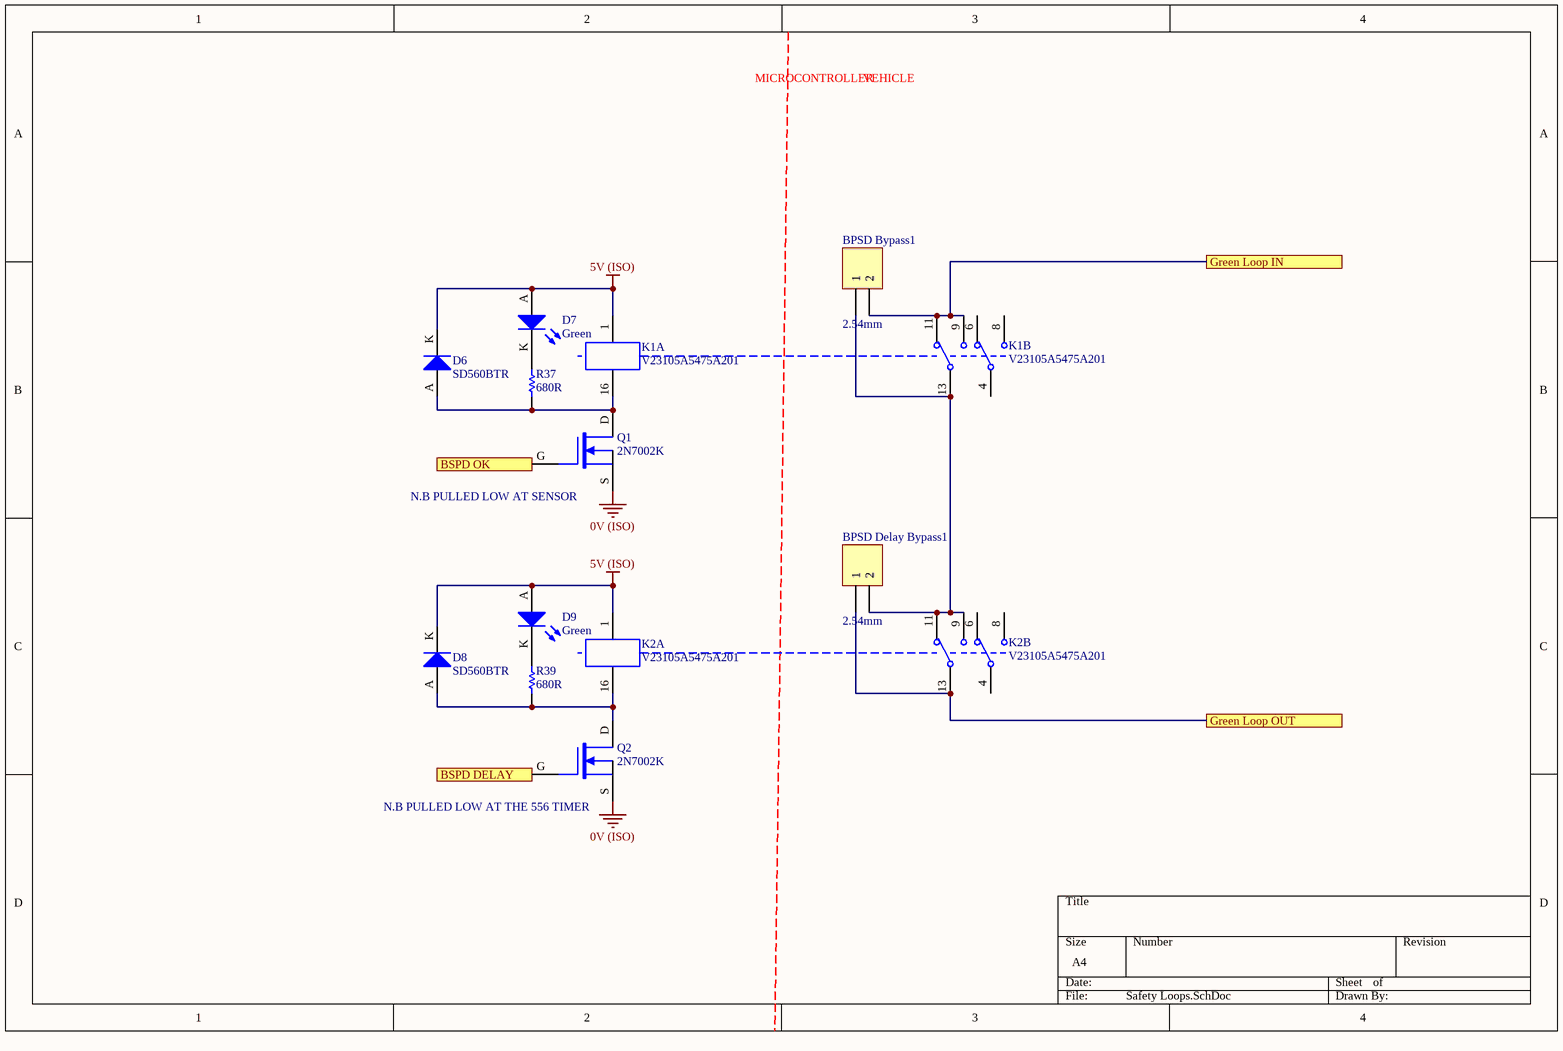
[diagram p5: Safety Loops.SchDoc]

### Parts
BPSD_Bypass1  2.54mm  [TH 2.54mm Header 1x2]
BPSD_Delay_Bypass1  2.54mm  [TH 2.54mm Header 1x2]
D6  SD560BTR  [SMB Diode]
D7  Green  [0805 LED]
D8  SD560BTR  [SMB Diode]
D9  Green  [0805 LED]
K1  V23105A5475A201  [TI 2-DIL]  (parts A,B of 2)
K2  V23105A5475A201  [TI 2-DIL]  (parts A,B of 2)
Q1  2N7002K  [ON SOT-23 MOSFET]
Q2  2N7002K  [ON SOT-23 MOSFET]
R37  680R  [0805]
R39  680R  [0805]

### Ports
BSPD DELAY, BSPD OK, Green Loop IN, Green Loop OUT

### Nets
0V (ISO): Q1.S Q2.S
5V (ISO): D6.K D7.A D8.K D9.A K1.1 K2.1
BSPD DELAY (ISO): Q2.G ; port BSPD DELAY
BSPD OK: Q1.G ; port BSPD OK
Green Loop IN: BPSD_Bypass1.2 K1.9 K1.11 ; port Green Loop IN
Green Loop OUT: BPSD_Delay_Bypass1.1 K2.13 ; port Green Loop OUT
NetBPSD_Bypass1_1: BPSD_Bypass1.1 BPSD_Delay_Bypass1.2 K1.13 K2.9 K2.11
NetD6_A: D6.A K1.16 Q1.D R37.1
NetD7_K: D7.K R37.2
NetD8_A: D8.A K2.16 Q2.D R39.1
NetD9_K: D9.K R39.2

Not connected (* = marked no-connect by the designer): K1 4 6 8; K2 4 6 8

### Notes on the sheet
- MICROCONTROLLER
- VEHICLE
- (near Q1) N.B PULLED LOW AT SENSOR
- (near Q2) N.B PULLED LOW AT THE 556 TIMER

### Library data of the parts
BPSD_Bypass1 BPSD_Delay_Bypass1 = TH 2.54mm Header 1x2: Positions: 2; Angle: 0; Flange: No; Contact: NA; Part Number: TH 2.54mm Header 1x2; Pitch: 2.54mm; Row Spacing: 2.54mm
D6 D8 = SD560BTR: as D10 on sheet Microcontroller; Part Number: SD560BTR; Digikey Part Number: 1655-1530-2-ND; Digikey Link: https://www.digikey.com/product-detail/en/smc-diode-solutions/SD560BTR/1655-1530-2-ND/6022620
D7 D9 = SML-210FTT86: Green LED Indication - Discrete 1.75V 0805 (2012 Metric); Manufacturer: ROHM Semiconductor; Part Number: SML-210FTT86; Colour: Green; Digikey Part Number: 511-1285-1-ND; Digikey Link: https://www.digikey.com/product-detail/en/rohm-semiconductor/SML-210FTT86/511-1285-1-ND/637098
K1 K2 = V23105A5475A201: 5V DPDT Relay 3A 220VDC; Manufacturer: Axicom; Part Number: V23105A5475A201; Digikey Part Number: PB383-ND; Digikey Link: https://www.digikey.com/products/en?mpart=V23105A5001A201&v=41
Q1 Q2 = 2N7002K: 60V 380mA, NFET MOSTFET (Small Signal); Manufacturer: ON Semiconductor; Published: 24-Mar-1999; LatestRevisionDate: 29-May-2009; LatestRevisionNote: IPC-7351 Footprint Added.; PackageVersion: Sep-2000; PackageReference: SOT-343; Publisher: Altium Limited; PackageDescription: 4-Pin SOT-343 Package 1.3 mm Pitch, 2.1 mm Lead Span; Part Number: 2N7002K; Digikey Part Number: 2N7002KCT-ND; Digikey Link: https://www.digikey.com/product-detail/en/on-semiconductor/2N7002K/2N7002KCT-ND/2060375; Qty: 30
R37 R39 = RC0805FR07680RL: Manufacturer: YAGEO; Tolerance: 0.01; Rated Voltage: 0.125W; Part Number: RC0805FR07680RL; Value: 680R; Material: FR-07

## Sheet CAN.SchDoc
size A4
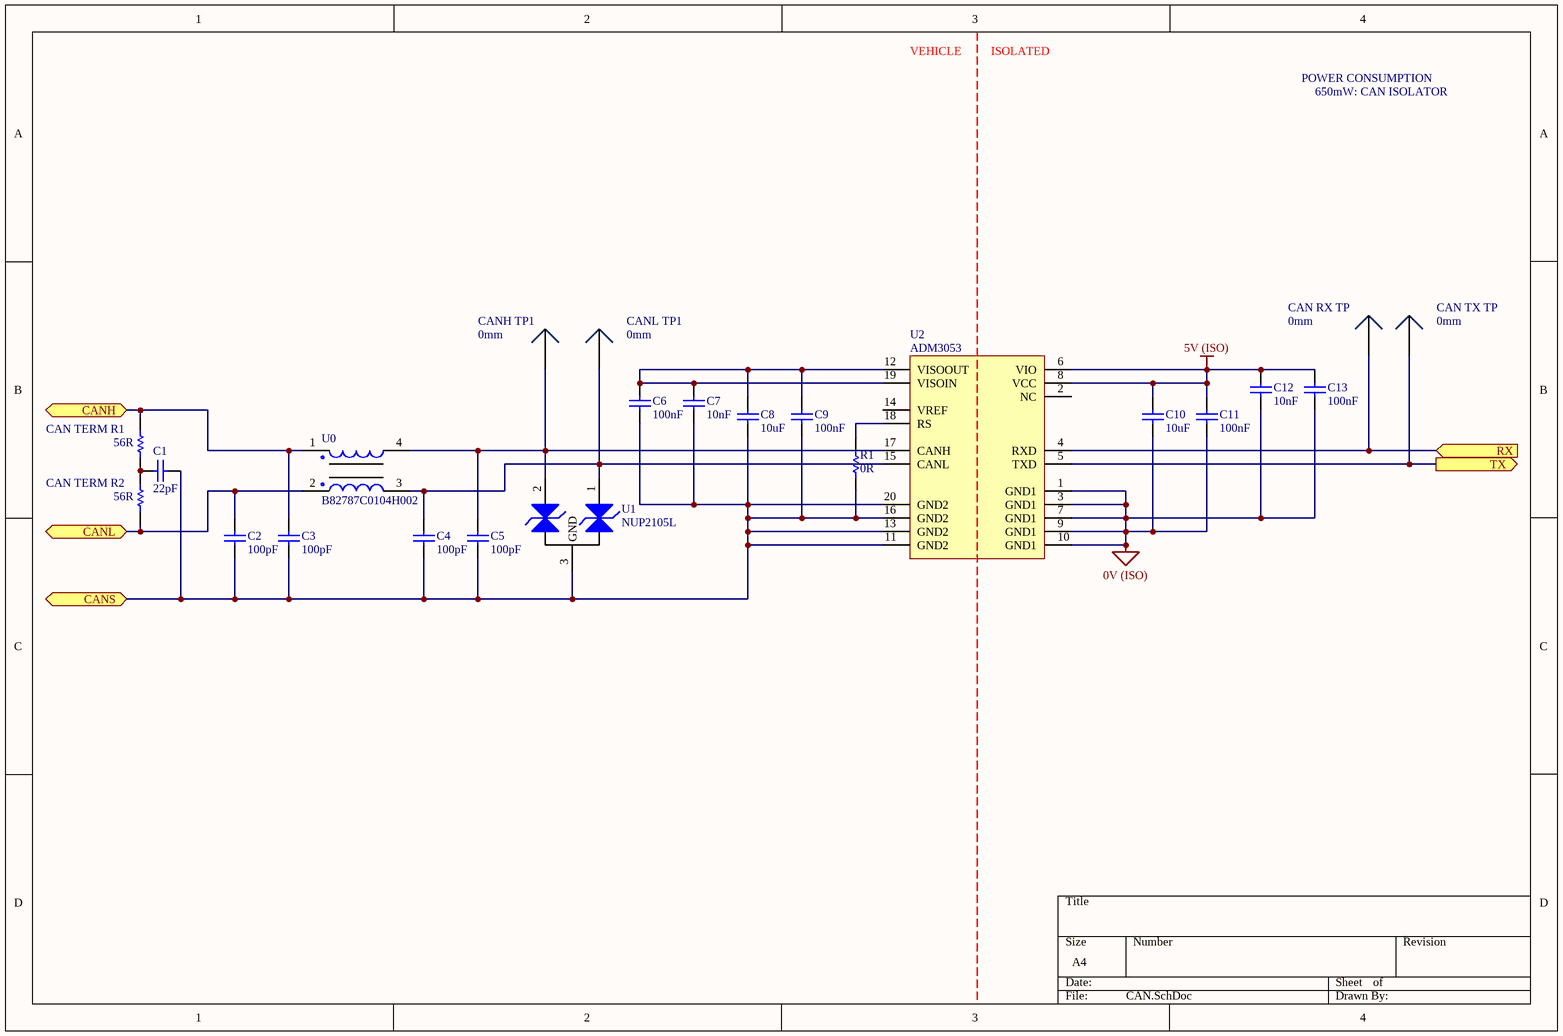
[diagram p6: CAN.SchDoc]

### Parts
C1  22pF  [0805]
C2  100pF  [0805]
C3  100pF  [0805]
C4  100pF  [0805]
C5  100pF  [0805]
C6  100nF  [0805]
C7  10nF  [1206]
C8  10uF  [0805]
C9  100nF  [0805]
C10  10uF  [0805]
C11  100nF  [0805]
C12  10nF  [1206]
C13  100nF  [0805]
CAN_RX_TP  0mm  [SMD Test Point]
CAN_TERM_R1  56R  [0805]
CAN_TERM_R2  56R  [0805]
CAN_TX_TP  0mm  [SMD Test Point]
CANH_TP1  0mm  [SMD Test Point]
CANL_TP1  0mm  [SMD Test Point]
R1  0R  [0805]
U0  B82787C0104H002  [TDK 4-PC Pad]
U1  NUP2105L  [ON SOT-23]
U2  ADM3053  [AD SOIC-W 20]

### Ports
CANH (bidir), CANL (bidir), CANS (bidir), RX (in), TX (out)

### Nets
0V (ISO): C10.1 C11.1 C12.1 C13.1 U2.1(GND1) U2.3(GND1) U2.7(GND1) U2.9(GND1) U2.10(GND1)
5V (ISO): C10.2 C11.2 C12.2 C13.2 U2.6(VIO) U2.8(VCC)
CANH: C3.2 CAN_TERM_R1.2 U0.1 ; port CANH
CANL: C2.2 CAN_TERM_R2.1 U0.2 ; port CANL
CANS: C1.1 C2.1 C3.1 C4.1 C5.1 C6.1 C7.1 C8.1 C9.1 R1.1 U1.3(GND) U2.11(GND2) U2.13(GND2) U2.16(GND2) U2.20(GND2) ; port CANS
NetC1_2: C1.2 CAN_TERM_R1.1 CAN_TERM_R2.2
NetC4_2: C4.2 CANL_TP1.1 U0.3 U1.1(CAN_H) U2.15(CANL)
NetC5_2: C5.2 CANH_TP1.1 U0.4 U1.2(CAN_L) U2.17(CANH)
NetC6_2: C6.2 C7.2 C8.2 C9.2 U2.12(VISOOUT) U2.19(VISOIN)
NetCAN_RX_TP_1: CAN_RX_TP.1 U2.4(RXD) ; port RX
NetCAN_TX_TP_1: CAN_TX_TP.1 U2.5(TXD) ; port TX
NetR1_2: R1.2 U2.18(RS)

Not connected (* = marked no-connect by the designer): U2 2(NC) 14(VREF)

### Notes on the sheet
- VEHICLE
- ISOLATED
- POWER CONSUMPTION
- 650mW: CAN ISOLATOR

### Library data of the parts
C1 = GCM21B5C1H220JA37L: as C40 on sheet Microcontroller; Part Number: GCM21B5C1H220JA37L; Value: 22pF
C2-C5 = GCM21B5C1H101JA37L: Manufacturer: muRata; Tolerance: 5%; Material: C0G; Rated Voltage: 50V; Part Number: GCM21B5C1H101JA37L; Value: 100pF
C6 C9 C11 C13 = GCM21BR71E104KA37L: as C18 on sheet BSPD; Part Number: GCM21BR71E104KA37L; Value: 100nF
C7 C12 = GCM3195C2A103JA16D: Manufacturer: muRata; Tolerance: 5%; Material: Ceramic; Rated Voltage: 100V; Part Number: GCM3195C2A103JA16D; Value: 10nF; Digikey Part Number: 490-4978-2-ND
C8 C10 = GRM21BR6YA106KE43L: as C14 on sheet BSPD; Part Number: GRM21BR6YA106KE43L; Value: 10uF; Digikey Part Number: 490-10514-6-ND
CAN_RX_TP CAN_TX_TP CANH_TP1 CANL_TP1 = SMD Test Point: as P1 on sheet BSPD; Part Number: SMD Test Point; Pitch: 0mm; Angle: 0
CAN_TERM_R1 CAN_TERM_R2 = RC0805FR0756RL: Manufacturer: YAGEO; Tolerance: 0.01; Rated Voltage: 0.125W; Part Number: RC0805FR0756RL; Value: 56R; Material: FR-07
R1 = RC0805FR070RL: as R18 on sheet Input Filter; Part Number: RC0805FR070RL; Value: 0R; Material: FR-07
U0 = B82787C0104H002: 100µH @ 100kHz 2 Line Common Mode Choke Surface Mount 5.8 kOhms @ 10MHz 150mA DCR 2Ohm; Manufacturer: EPCOS (TDK); Part Number: B82787C0104H002; Inductance: 100µH @ 100kHz; Impedence: 5.8 kOhms @ 10MHz; Material: Wirewound; Rated Current: 150mA; Digikey Part Number: 495-4598-1-ND; Digikey Link: https://www.digikey.com/product-detail/en/epcos-tdk/B82787C0104H002/495-4598-2-ND/3680998
U1 = NUP2105L: Dual Line CAN Bus Protector; Manufacturer: ON Semiconductor; Part Number: NUP2105L; Digikey Part Number: NUP2105LT1GOSCT-ND; Digikey Link: https://www.digikey.com/product-detail/en/on-semiconductor/NUP2105LT1G/NUP2105LT1GOSCT-ND/1485001
U2 = ADM3053: Isolated CAN Transceiver; Manufacturer: Analogue Devices; Part Number: ADM3053; Digikey Part Number: ADM3053BRWZ-ND; Digikey Link: https://www.digikey.com/product-detail/en/analog-devices-inc/ADM3053BRWZ/ADM3053BRWZ-ND/2709332

## Sheet Isolation.SchDoc
size A4
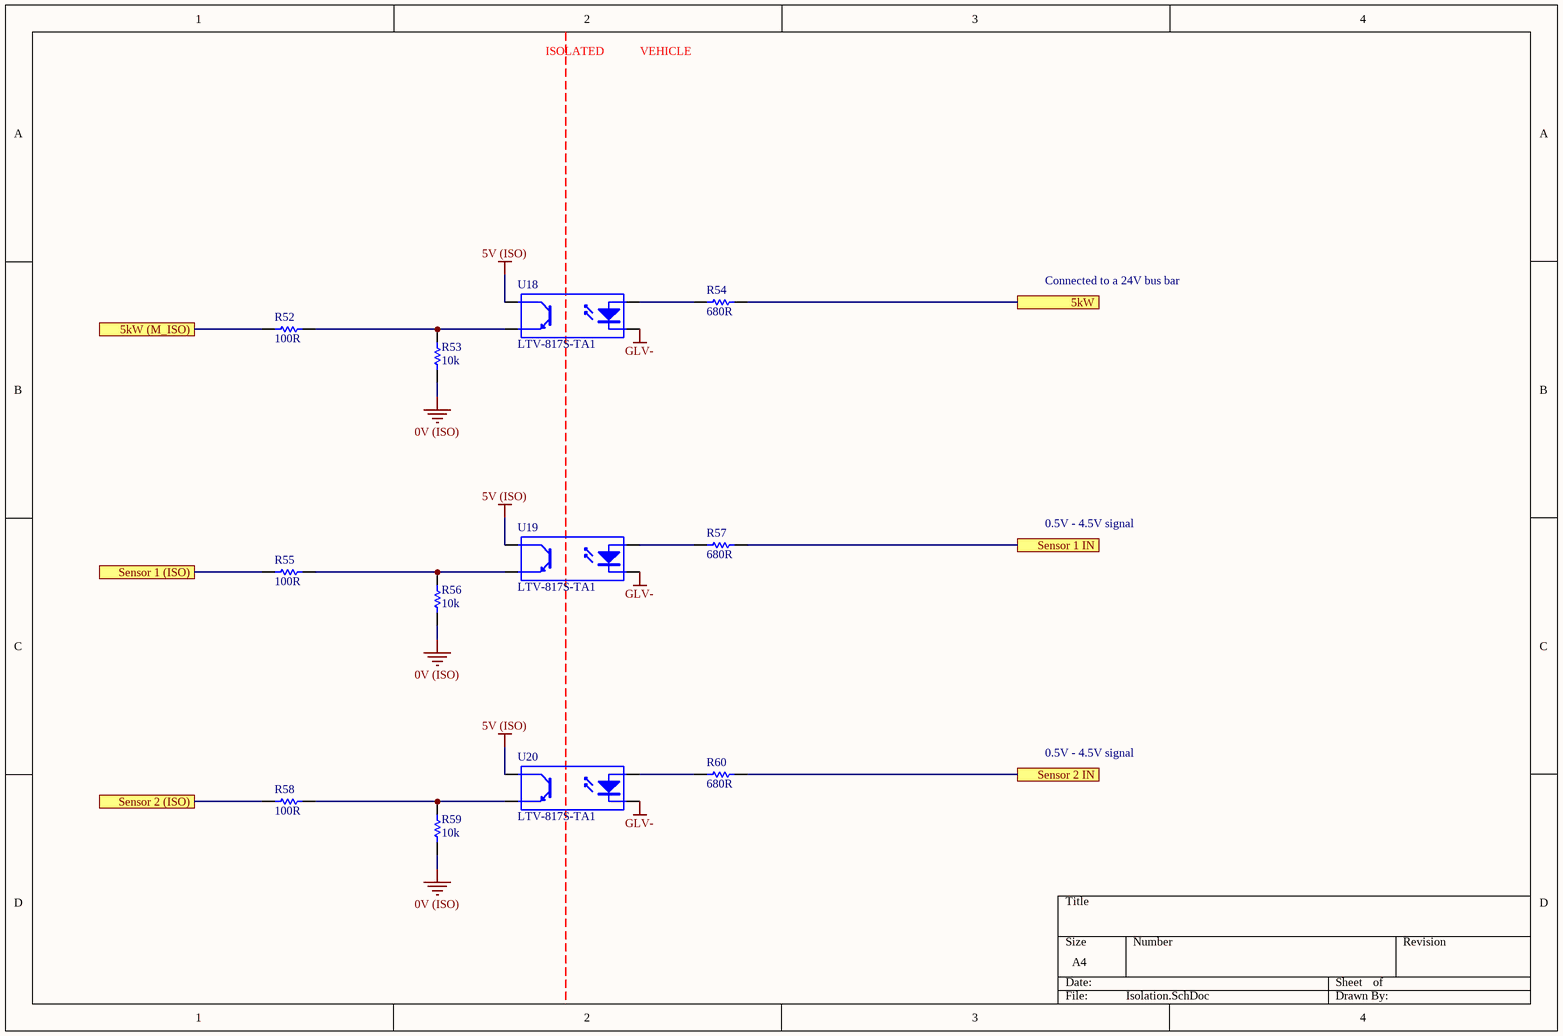
[diagram p7: Isolation.SchDoc]

### Parts
R52  100R  [0805]
R53  10k  [0805]
R54  680R  [0805]
R55  100R  [0805]
R56  10k  [0805]
R57  680R  [0805]
R58  100R  [0805]
R59  10k  [0805]
R60  680R  [0805]
U18  LTV-817S-TA1  [ON 4-SMD]
U19  LTV-817S-TA1  [ON 4-SMD]
U20  LTV-817S-TA1  [ON 4-SMD]

### Ports
5kW, 5kW (M_ISO), Sensor 1 (ISO), Sensor 1 IN, Sensor 2 (ISO), Sensor 2 IN

### Nets
0V (ISO): R53.1 R56.1 R59.1
5V (ISO): U18.4(C) U19.4(C) U20.4(C)
GLV-: U18.2(K) U19.2(K) U20.2(K)
5kW: R54.2 ; port 5kW
5kW (ISO): R52.1 ; port 5kW (M_ISO)
Sensor 1 In: R55.1 R57.2 ; port Sensor 1 IN, port Sensor 1 (ISO)
Sensor 2 In: R58.1 R60.2 ; port Sensor 2 IN, port Sensor 2 (ISO)
NetR52_2: R52.2 R53.2 U18.3(E)
NetR54_1: R54.1 U18.1(A)
NetR55_2: R55.2 R56.2 U19.3(E)
NetR57_1: R57.1 U19.1(A)
NetR58_2: R58.2 R59.2 U20.3(E)
NetR60_1: R60.1 U20.1(A)

### Notes on the sheet
- ISOLATED
- VEHICLE
- Connected to a 24V bus bar
- 0.5V - 4.5V signal

### Library data of the parts
R52 R55 R58 = RC0805FR07100RL: Manufacturer: YAGEO; Tolerance: 0.01; Rated Voltage: 0.125W; Part Number: RC0805FR07100RL; Value: 100R; Material: FR-07
R53 R56 R59 = RC0805FR0710KL: as R2 on sheet BSPD; Part Number: RC0805FR0710KL; Value: 10k; Material: FR-07
R54 R57 R60 = RC0805FR07680RL: as R37 on sheet Safety Loops; Part Number: RC0805FR07680RL; Value: 680R; Material: FR-07
U18-U20 = LTV-817S-TA1: 35V 50ma Optocoupler (VF=1.2V); Manufacturer: Lite-On Inc; Part Number: LTV-817S-TA1; Digikey Part Number: 160-1893-2-ND; Digikey Link: https://www.digikey.com/product-detail/en/lite-on-inc/LTV-817S-TA1/160-1893-2-ND/388451

## Nets that join several sheets
0V (ISO): BSPD (22 pins), 4 Channel ADC (C30.1 U12.3), Input Filter (C48.1 C49.1 R20.1 R24.1), Microcontroller (32 pins), Safety Loops (Q1.S Q2.S), CAN (9 pins), Isolation (R53.1 R56.1 R59.1)
5V (ISO): BSPD (18 pins), 4 Channel ADC (C30.2 U12.1 U12.8), Microcontroller (7 pins), Safety Loops (6 pins), CAN (6 pins), Isolation (U18.4 U19.4 U20.4)
GLV-: Top Level (Sensors_Plug.1 Sensors_Plug.6 Universal_Plug.11), Isolation (U18.2 U19.2 U20.2)
5kW: Top Level (Universal_Plug.8), Isolation (R54.2)
5kW (ISO): BSPD (P3.1 R?.1 U5.4), Microcontroller (U16.29), Isolation (R52.1)
BSPD DELAY (ISO): BSPD (R6.1 U3.9), Microcontroller (U16.25), Safety Loops (Q2.G)
BSPD OK: BSPD (6 pins), Microcontroller (U16.30), Safety Loops (Q1.G)
CANH: Top Level (Universal_Plug.4), CAN (C3.2 CAN_TERM_R1.2 U0.1)
CANL: Top Level (Universal_Plug.5), CAN (C2.2 CAN_TERM_R2.1 U0.2)
CANS: Top Level (Universal_Plug.1), CAN (15 pins)
CLOCK: BSPD (6 pins), Microcontroller (U16.26)
Green Loop IN: Top Level (Universal_Plug.10), Safety Loops (BPSD_Bypass1.2 K1.9 K1.11)
Green Loop OUT: Top Level (Universal_Plug.9), Safety Loops (BPSD_Delay_Bypass1.1 K2.13)
H REF: BSPD (5 pins), 4 Channel ADC (U12.6)
L REF: BSPD (5 pins), 4 Channel ADC (U12.7)
NetC48_2: BSPD (P10.1 U4.8 U4.11), 4 Channel ADC (U12.4), Input Filter (C48.2 R19.2)
NetC49_2: BSPD (P6.1 U4.4 U4.7), 4 Channel ADC (U12.5), Input Filter (C49.2 R22.2)
NetCAN_RX_TP_1: Microcontroller (U16.46), CAN (CAN_RX_TP.1 U2.4)
NetCAN_TX_TP_1: Microcontroller (U16.45), CAN (CAN_TX_TP.1 U2.5)
NetP9_1: BSPD (6 pins), Microcontroller (U16.28)
NetP11_1: BSPD (5 pins), Microcontroller (U16.27)
NetR43_1: 4 Channel ADC (U12.10), Microcontroller (R43.1 U16.42)
NetR44_1: 4 Channel ADC (U12.9), Microcontroller (R44.1 U16.43)
Sensor 1 In: Top Level (Sensors_Plug.2), Input Filter (R18.1), Isolation (R55.1 R57.2)
Sensor 2 In: Top Level (Sensors_Plug.5), Input Filter (R21.1), Isolation (R58.1 R60.2)